# EAGLE schematic H04 (EAGLE 6.6.0)

## Sheet 1 of 3
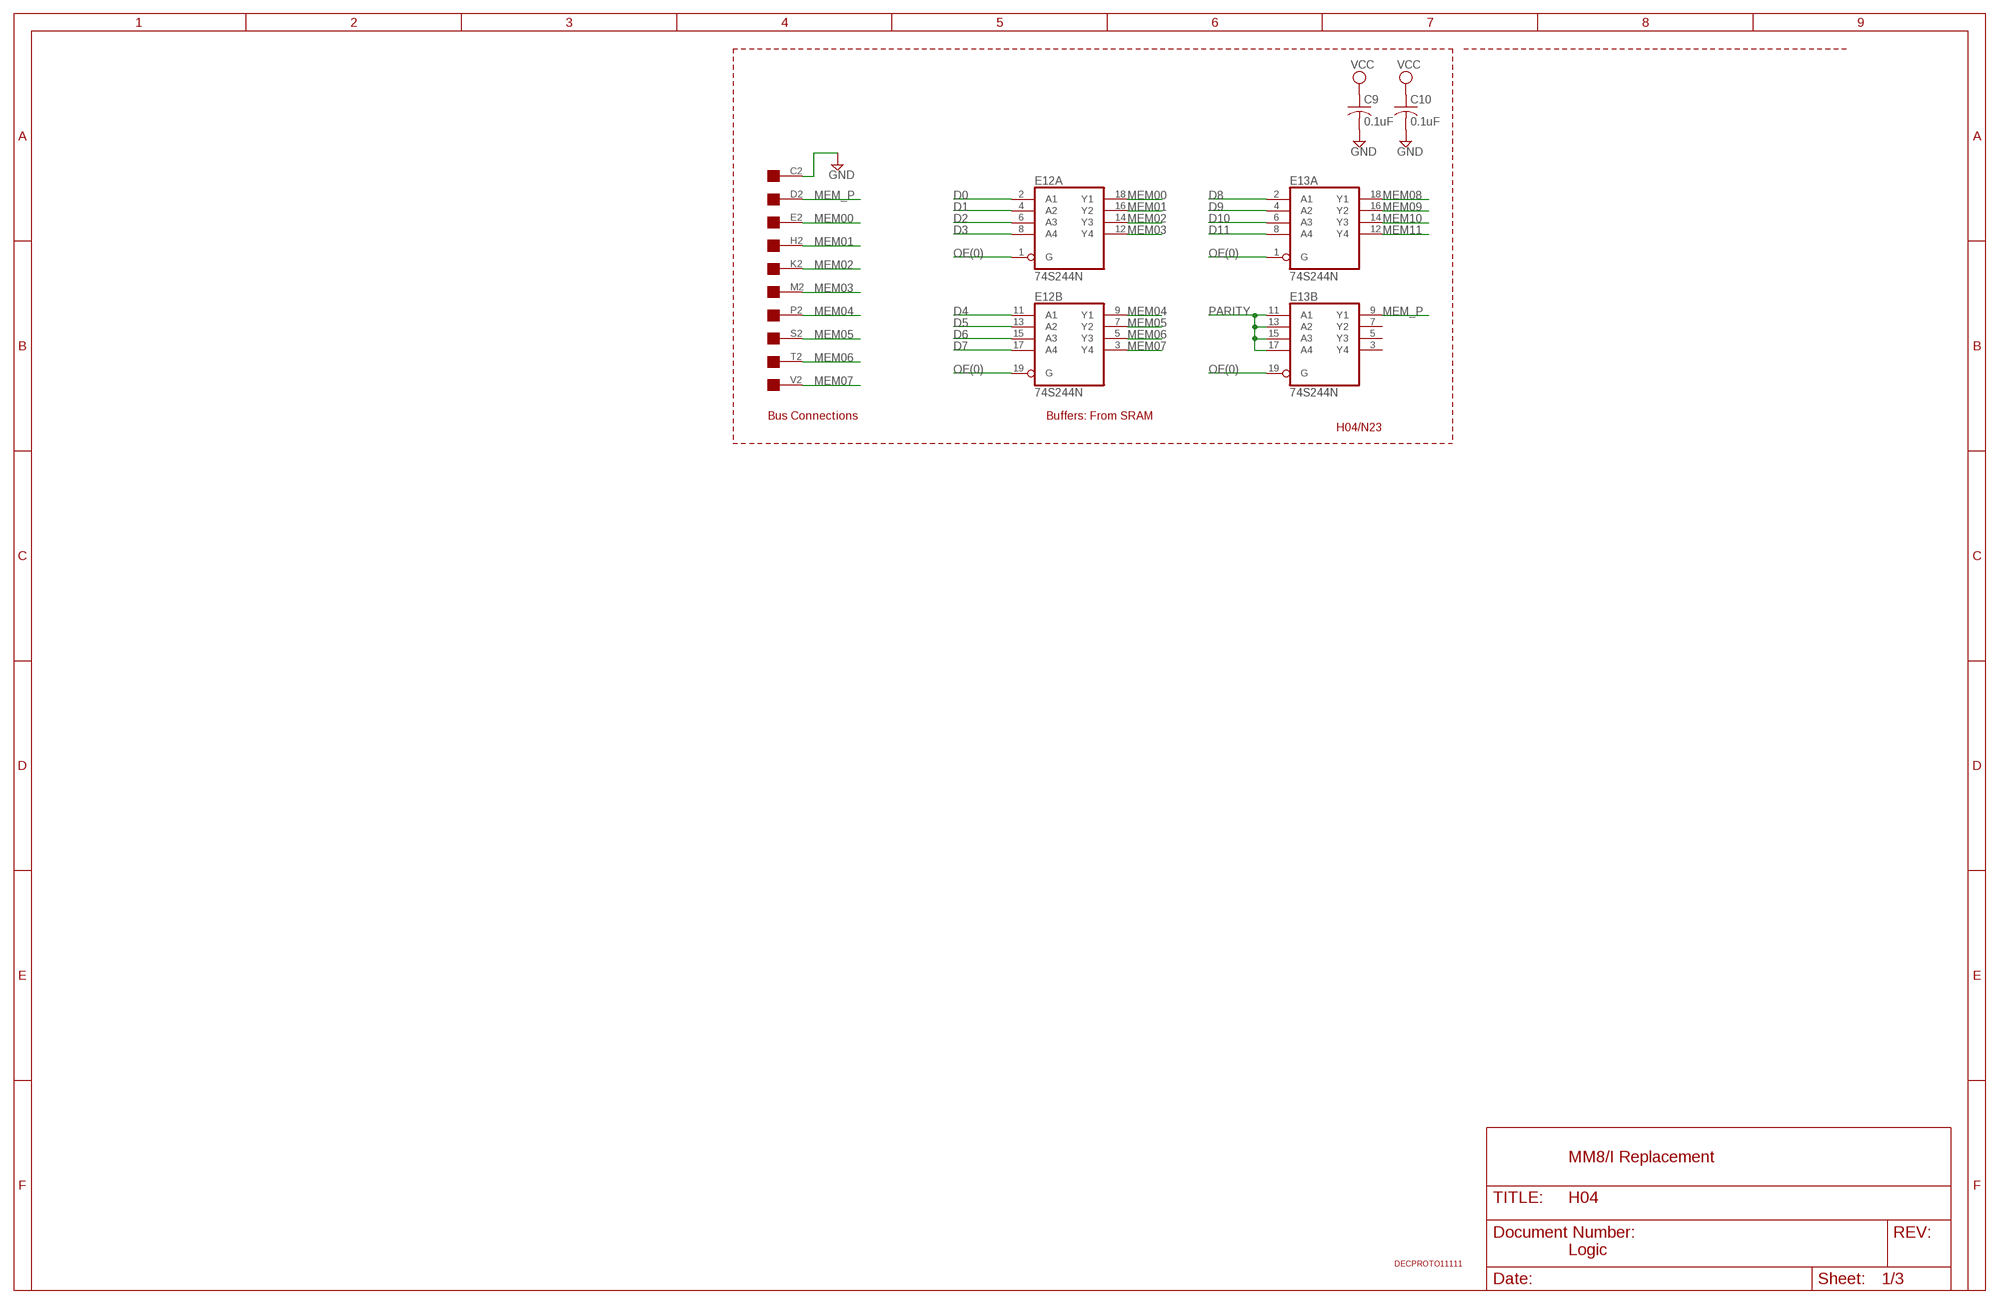
[diagram p0: schematic, sheet 1]

### Parts
C9  0.1uF  C-US050-025X075  [C050-025X075]
C10  0.1uF  C-US050-025X075  [C050-025X075]
E12  74S244N  [DIL20]
E13  74S244N  [DIL20]
H04  EDGE-1  [EDGE-CON1]
U$6  DECPROTO11111  [DECPROTO11111]

### Nets
D0: E12.2(A:A1) ; also sheet 2
D1: E12.4(A:A2) ; also sheet 2
D2: E12.6(A:A3) ; also sheet 2
D3: E12.8(A:A4) ; also sheet 2
D4: E12.11(B:A1) ; also sheet 2
D5: E12.13(B:A2) ; also sheet 2
D6: E12.15(B:A3) ; also sheet 2
D7: E12.17(B:A4) ; also sheet 2
D8: E13.2(A:A1) ; also sheet 2
D9: E13.4(A:A2) ; also sheet 2
D10: E13.6(A:A3) ; also sheet 2
D11: E13.8(A:A4) ; also sheet 2
GND [supply]: C9.2 C10.2 H04.C2 ; also sheet 2
MEM00: E12.18(A:Y1) H04.E2
MEM01: E12.16(A:Y2) H04.H2
MEM02: E12.14(A:Y3) H04.K2
MEM03: E12.12(A:Y4) H04.M2
MEM04: E12.9(B:Y1) H04.P2
MEM05: E12.7(B:Y2) H04.S2
MEM06: E12.5(B:Y3) H04.T2
MEM07: E12.3(B:Y4) H04.V2
MEM08: E13.18(A:Y1) ; also sheet 2
MEM09: E13.16(A:Y2) ; also sheet 2
MEM10: E13.14(A:Y3) ; also sheet 2
MEM11: E13.12(A:Y4) ; also sheet 2
MEM_P: E13.9(B:Y1) H04.D2
OE(0): E12.1(A:G) E12.19(B:G) E13.1(A:G) E13.19(B:G) ; also sheet 2
PARITY: E13.11(B:A1) E13.13(B:A2) E13.15(B:A3) E13.17(B:A4) ; also sheet 2
VCC [supply]: C9.1 C10.1 ; also sheet 2
Unconnected: E13.3(B:Y4) E13.5(B:Y3) E13.7(B:Y2) H04.A2 H04.B2 H04.F2 H04.J2 H04.L2 H04.N2 H04.R2 H04.U2

### Notes on the sheet
- Bus Connections | Buffers: From SRAM
- H04/N23
- MM8/I Replacement
- Logic

## Sheet 2 of 3
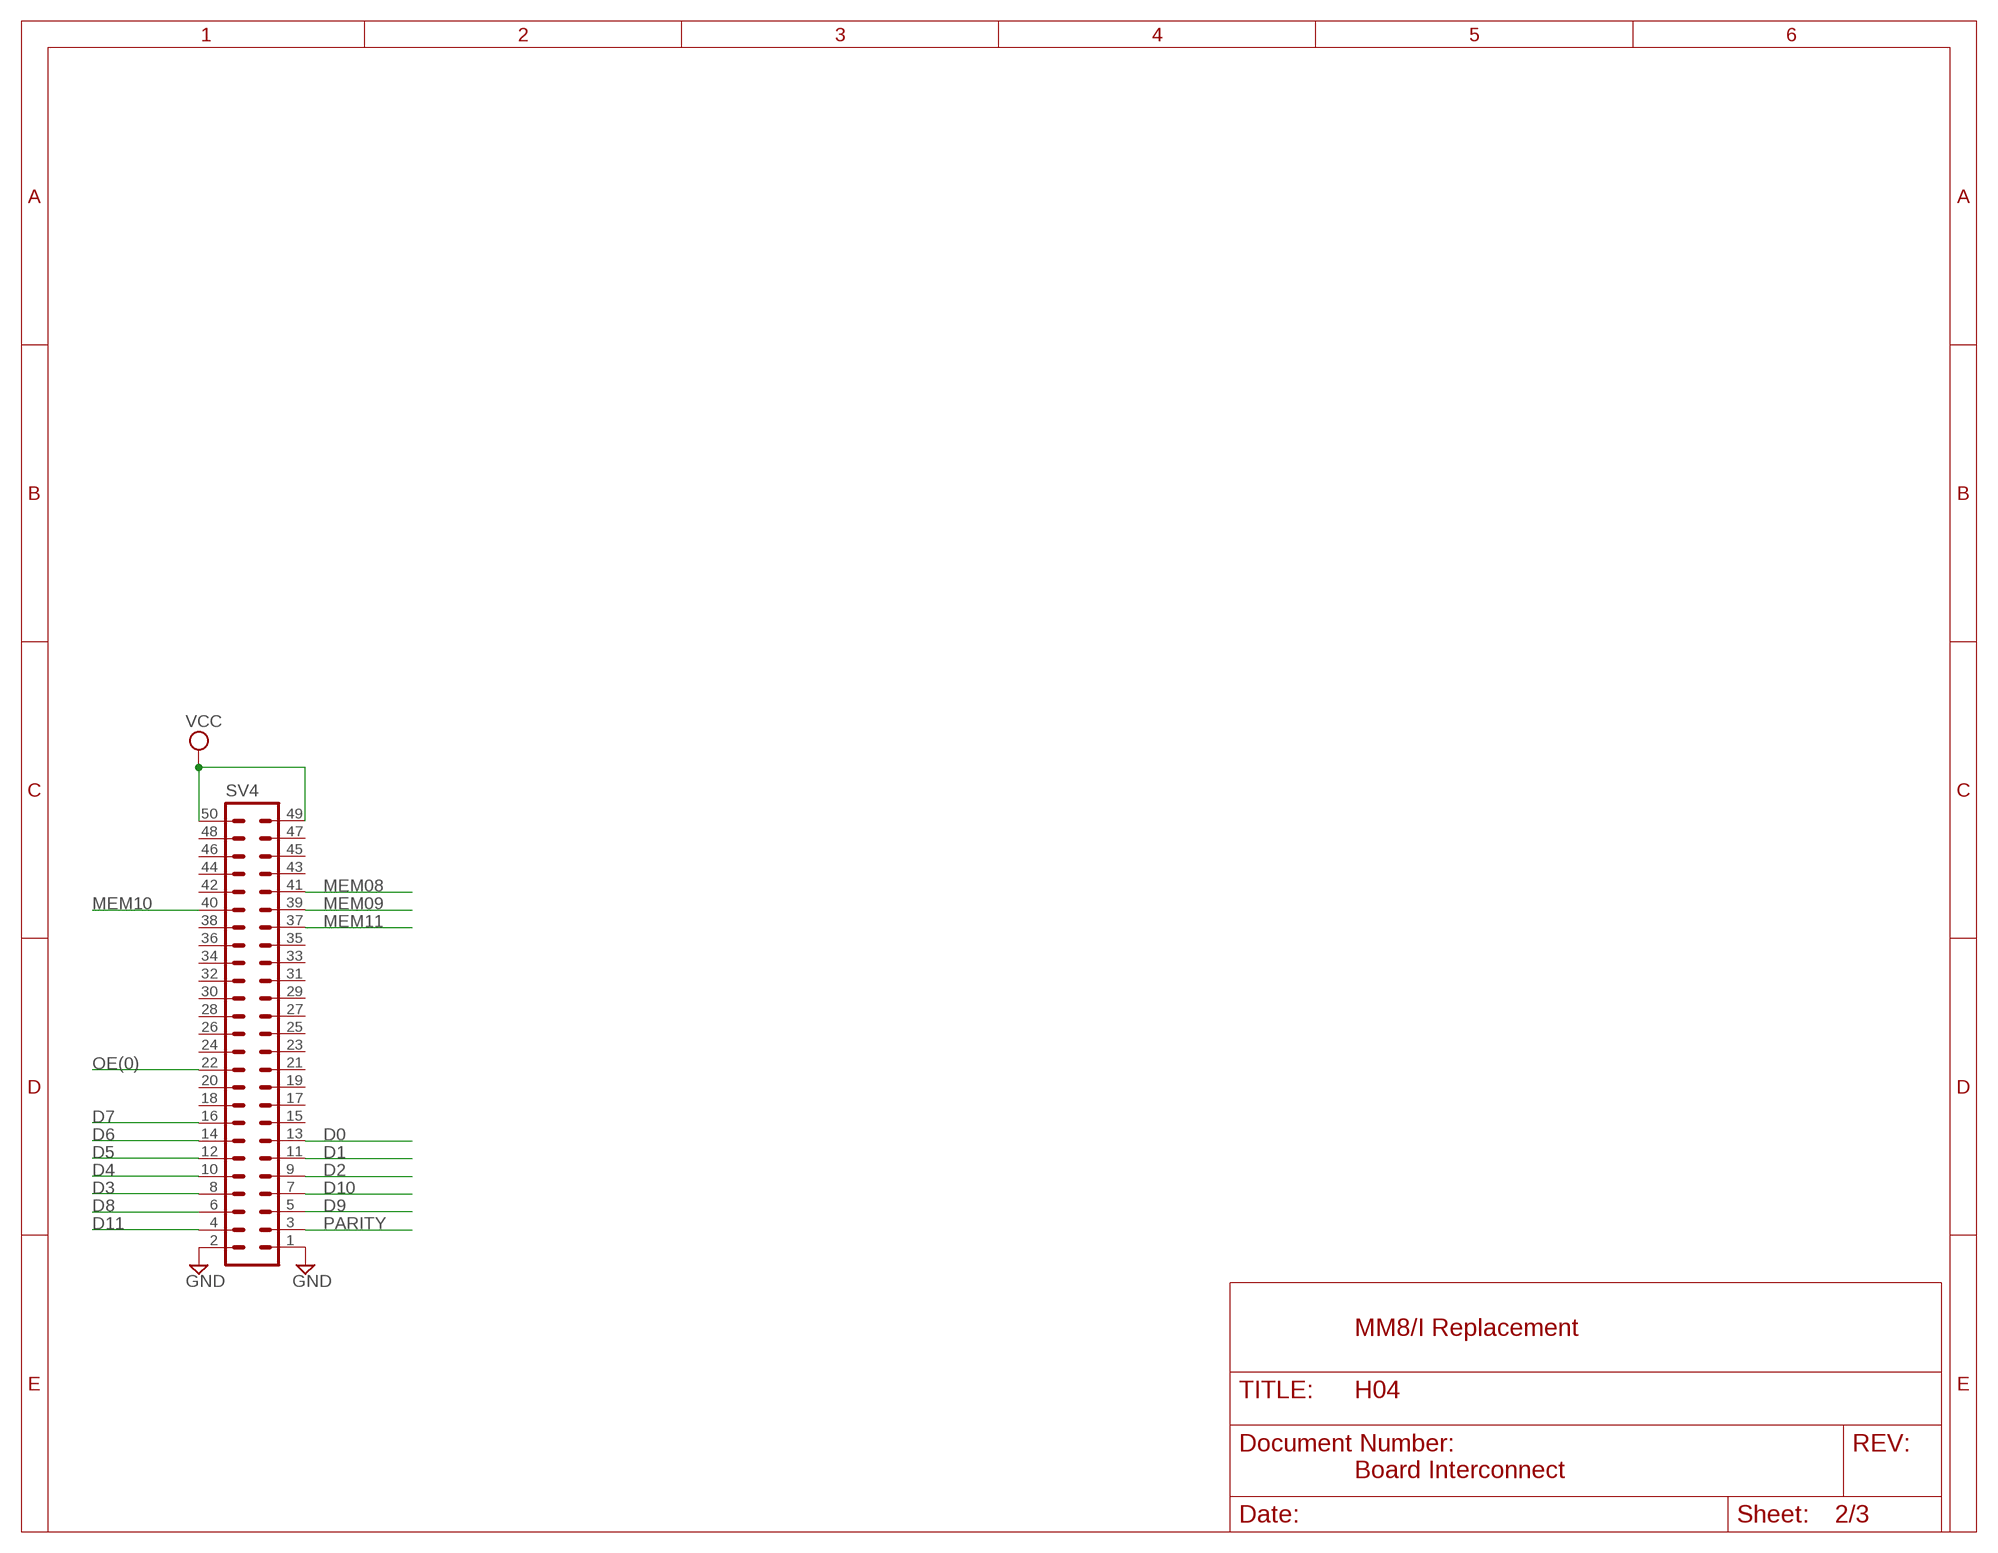
[diagram p1: schematic, sheet 2]

### Parts
SV4  ML50L  [ML50L]

### Nets
D0: SV4.13 ; also sheet 1
D1: SV4.11 ; also sheet 1
D2: SV4.9 ; also sheet 1
D3: SV4.8 ; also sheet 1
D4: SV4.10 ; also sheet 1
D5: SV4.12 ; also sheet 1
D6: SV4.14 ; also sheet 1
D7: SV4.16 ; also sheet 1
D8: SV4.6 ; also sheet 1
D9: SV4.5 ; also sheet 1
D10: SV4.7 ; also sheet 1
D11: SV4.4 ; also sheet 1
GND [supply]: SV4.1 SV4.2 ; also sheet 1
MEM08: SV4.41 ; also sheet 1
MEM09: SV4.39 ; also sheet 1
MEM10: SV4.40 ; also sheet 1
MEM11: SV4.37 ; also sheet 1
OE(0): SV4.22 ; also sheet 1
PARITY: SV4.3 ; also sheet 1
VCC [supply]: SV4.49 SV4.50 ; also sheet 1
Unconnected: SV4.15 SV4.17 SV4.18 SV4.19 SV4.20 SV4.21 SV4.23 SV4.24 SV4.25 SV4.26 SV4.27 SV4.28 SV4.29 SV4.30 SV4.31 SV4.32 SV4.33 SV4.34 SV4.35 SV4.36 SV4.38 SV4.42 SV4.43 SV4.44 SV4.45 SV4.46 SV4.47 SV4.48

### Notes on the sheet
- MM8/I Replacement
- Board Interconnect

## Sheet 3 of 3
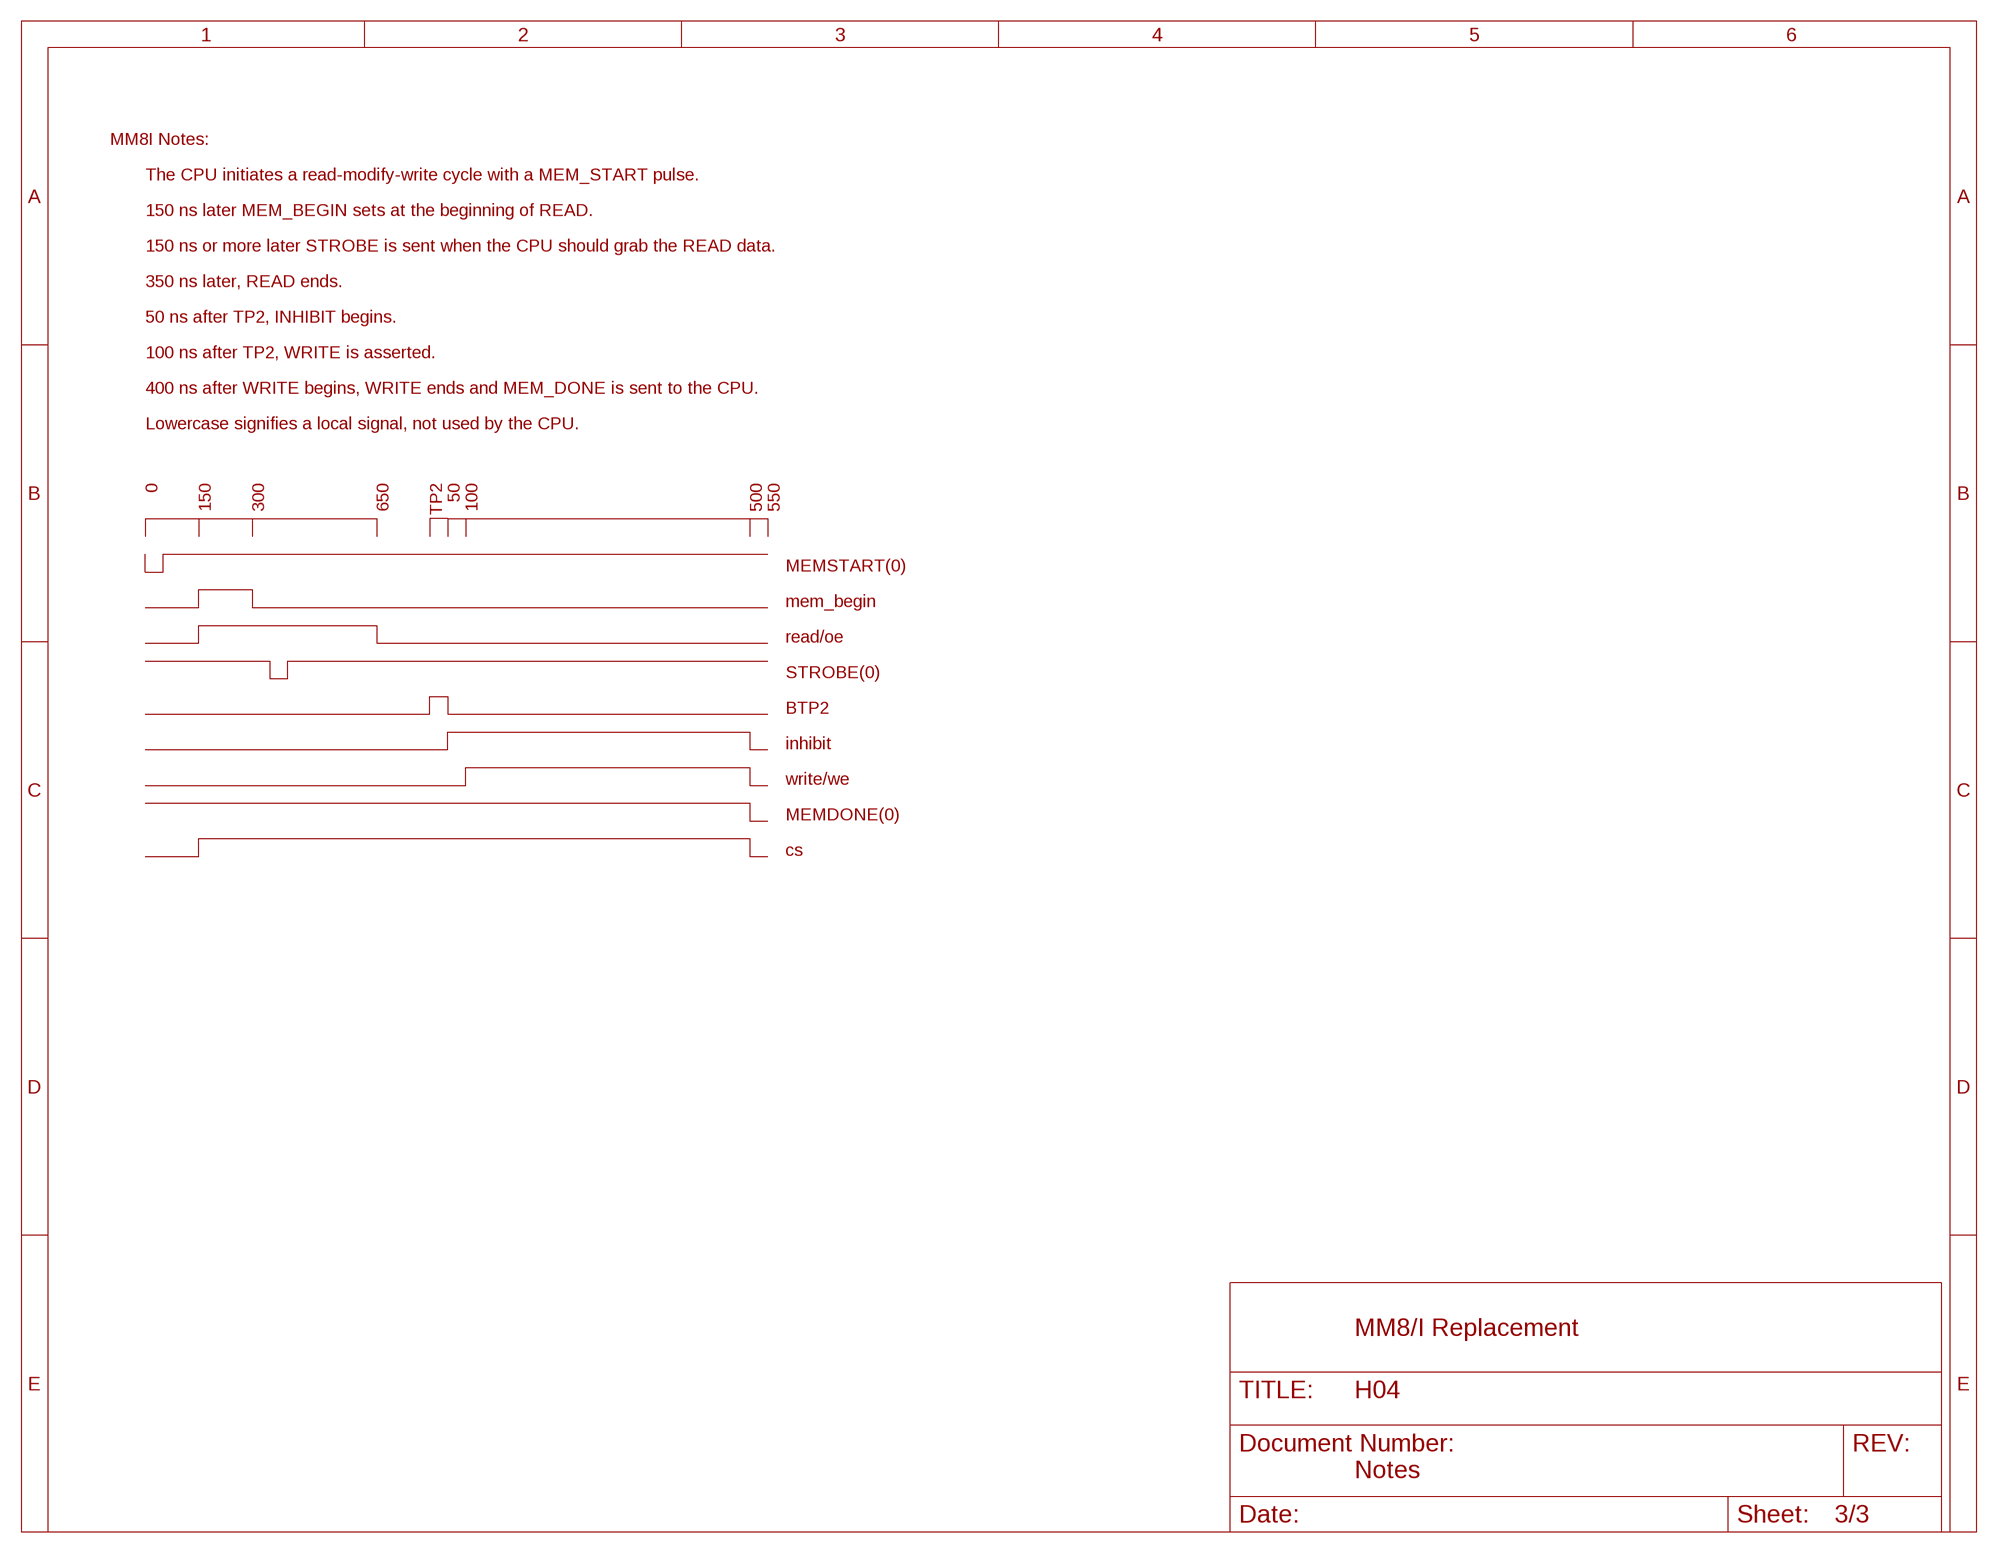
[diagram p2: schematic, sheet 3]

### Notes on the sheet
- MM8I Notes:
- The CPU initiates a read-modify-write cycle with a MEM_START pulse.
- 150 ns later MEM_BEGIN sets at the beginning of READ.
- 150 ns or more later STROBE is sent when the CPU should grab the READ data.
- 350 ns later, READ ends.
- 50 ns after TP2, INHIBIT begins.
- 100 ns after TP2, WRITE is asserted.
- 400 ns after WRITE begins, WRITE ends and MEM_DONE is sent to the CPU.
- Lowercase signifies a local signal, not used by the CPU.
- 0 | 150 | 300 | 650 | TP2 | 50 | 100 | 500 | 550
- MEMSTART(0)
- mem_begin
- read/oe
- STROBE(0)
- BTP2
- inhibit
- write/we
- MEMDONE(0)
- cs
- MM8/I Replacement
- Notes

## Power pins joined to a net without a drawn wire
GND: E12.10(P:GND) E13.10(P:GND)
VCC: E12.20(P:VCC) E13.20(P:VCC)

## Library data of the parts
C9 C10 = rcl:C-US: CAPACITOR, American symbol
E12 E13 = 74xx-us:74*244: Octal BUFFER and LINE DRIVER, 3-state
H04 = dec-con:EDGE-1: Single-Sided DEC Edge Connector -- (side 2)
SV4 = con-ml:ML50L: HARTING; OC_FARNELL: unknown; OC_NEWARK: unknown
U$6 = dec-con:DECPROTO: Various small DEC boards stuck together with break-away tab routing.

## Net classes
1 supply: width 0.711 mm